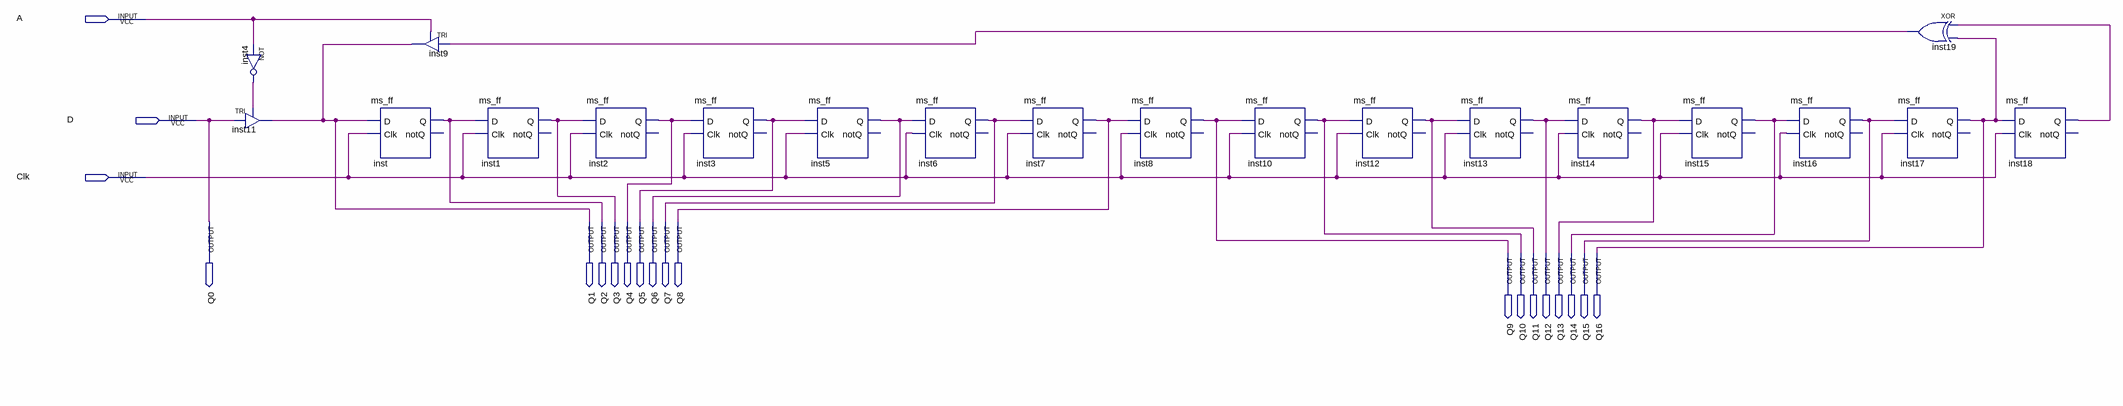
[diagram p0: schematic sheet]
// Quartus schematic mod_block.bdf as structural Verilog: 20 symbols, 20 pins
module mod_block (
  input  A,
  input  D,
  input  Clk,
  output Q0,
  output Q1,
  output Q2,
  output Q3,
  output Q4,
  output Q5,
  output Q6,
  output Q7,
  output Q8,
  output Q9,
  output Q10,
  output Q11,
  output Q12,
  output Q13,
  output Q14,
  output Q15,
  output Q16
);

  wire inst4_out, inst18_q, inst19_out;

  not inst4 (inst4_out, A);
  TRI inst11 (.IN(D), .OE(inst4_out), .OUT(Q1));
  ms_ff inst (.D(Q1), .Clk(Clk), .Q(Q2));  // open: notQ
  TRI inst9 (.IN(inst19_out), .OE(A), .OUT(Q1));
  ms_ff inst1 (.D(Q2), .Clk(Clk), .Q(Q3));  // open: notQ
  ms_ff inst2 (.D(Q3), .Clk(Clk), .Q(Q4));  // open: notQ
  ms_ff inst3 (.D(Q4), .Clk(Clk), .Q(Q5));  // open: notQ
  ms_ff inst5 (.D(Q5), .Clk(Clk), .Q(Q6));  // open: notQ
  ms_ff inst6 (.D(Q6), .Clk(Clk), .Q(Q7));  // open: notQ
  ms_ff inst7 (.D(Q7), .Clk(Clk), .Q(Q8));  // open: notQ
  ms_ff inst8 (.D(Q8), .Clk(Clk), .Q(Q9));  // open: notQ
  ms_ff inst10 (.D(Q9), .Clk(Clk), .Q(Q10));  // open: notQ
  ms_ff inst12 (.D(Q10), .Clk(Clk), .Q(Q11));  // open: notQ
  ms_ff inst13 (.D(Q11), .Clk(Clk), .Q(Q12));  // open: notQ
  ms_ff inst14 (.D(Q12), .Clk(Clk), .Q(Q13));  // open: notQ
  ms_ff inst15 (.D(Q13), .Clk(Clk), .Q(Q14));  // open: notQ
  ms_ff inst16 (.D(Q14), .Clk(Clk), .Q(Q15));  // open: notQ
  xor inst19 (inst19_out, inst18_q, Q16);
  ms_ff inst17 (.D(Q15), .Clk(Clk), .Q(Q16));  // open: notQ
  ms_ff inst18 (.D(Q16), .Clk(Clk), .Q(inst18_q));  // open: notQ

  assign Q0 = D;
endmodule
